# Altium schematic sheet Amplifier.SchDoc
size A4; SheetNumber: 1; SheetTotal: 1
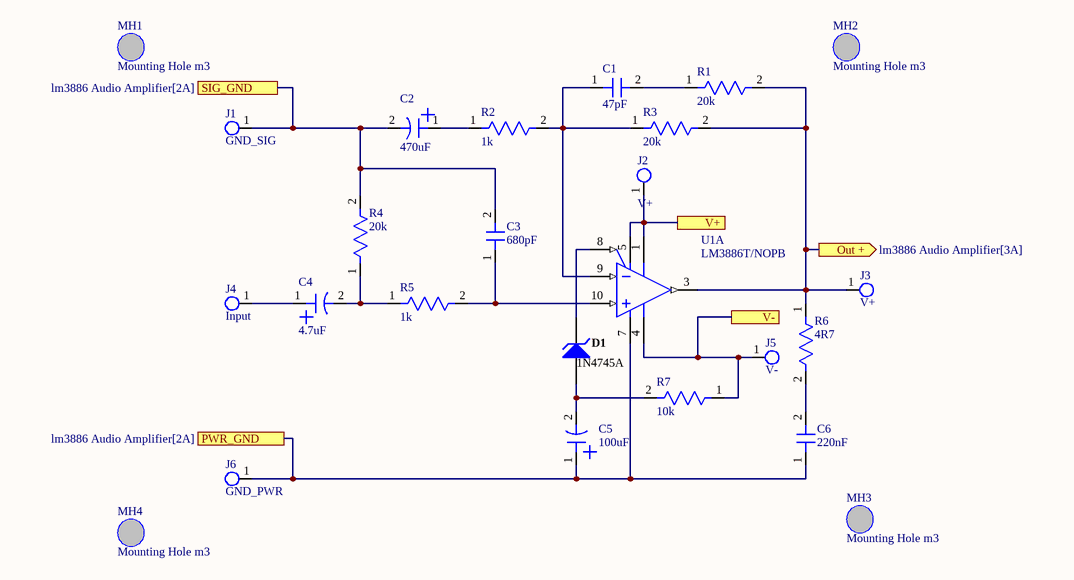
[diagram p0: Amplifier.SchDoc]

## Parts
C1  47pF  [Capacitor P5 2.4x4.4mm]
C2  470uF  [Capacitor electrolytic 10x16mm]
C3  680pF  [Capacitor P5 2.4x4.4mm]
C4  4.7uF  [Capacitor electrolytic 5x11mm]
C5  100uF  [Capacitor electrolytic 6x11mm]
C6  220nF  [Capacitor P5 5x7.5mm]
D1  1N4745A  [FAIR-DO-41-2_V]
J1  GND_SIG  [Terminal 6.3mm male]
J2  V+  [Terminal 6.3mm male]
J3  V+  [Terminal 6.3mm male]
J4  Input  [Terminal 6.3mm male]
J5  V-  [Terminal 6.3mm male]
J6  GND_PWR  [Terminal 6.3mm male]
MH1  Mounting Hole m3  [Mounting Hole]
MH2  Mounting Hole m3  [Mounting Hole]
MH3  Mounting Hole m3  [Mounting Hole]
MH4  Mounting Hole m3  [Mounting Hole]
R1  20k  [Resistor 0207 1/4W]
R2  1k  [Resistor 0207 1/4W]
R3  20k  [Resistor 0207 1/4W]
R4  20k  [Resistor 0207 1/4W]
R5  1k  [Resistor 0207 1/4W]
R6  4R7  [Resistor 0617 2W]
R7  10k  [Resistor 0207 1/4W]
U1  LM3886T/NOPB  [TI-NDJ11]  (part A of 2)

## Ports
Out + (out, see lm3886 Audio Amplifier[3A]), PWR_GND (see lm3886 Audio Amplifier[2A]), SIG_GND (see lm3886 Audio Amplifier[2A]), V+ (see lm3886 Audio Amplifier[2A]), V- (see lm3886 Audio Amplifier[2A])

## Nets
Out +: J3.1 R1.2 R3.2 R6.1 U1.3(OUTPUT) ; port Out +
PWR_GND: C5.1 C6.1 J6.1 U1.7(GND) ; port PWR_GND
SIG_GND: C2.2 C3.2 J1.1 R4.2 ; port SIG_GND
V+: J2.1 U1.1(V+) U1.5(V+) ; port V+
V-: J5.1 R7.1 U1.4(V-) ; port V-
NetC1_1: C1.1 R2.2 R3.1 U1.9(VIN-)
NetC1_2: C1.2 R1.1
NetC2_1: C2.1 R2.1
NetC3_1: C3.1 R5.2 U1.10(VIN+)
NetC4_1: C4.1 J4.1
NetC4_2: C4.2 R4.1 R5.1
NetC5_2: C5.2 D1.1(A) R7.2
NetC6_2: C6.2 R6.2
NetD1_2: D1.2(K) U1.8(MUTE)

## Library data of the parts
C1 C3 C6 = Capacitor
C2 C4 C5 = Capacitor Polar
D1 = CMP-0892-00004-1: Zener Diode, 16V, 1W, 5%, -65 to 200 degC, 2-Pin DO-41, Body 2.72 x 5.2 mm, RoHS; Manufacturer: Fairchild Semiconductor; VZ (Max.) (V): 16.8; PD (W): 1; IR (uA): 5; Test Current IZ (mA): 15.5; VZ (Min.) (V): 15.2; ZZ (Max) (ohm): 14; ComponentLink2Description: Datasheet; DatasheetVersion: Rev. H3; Tolerance: 5%; Mounting Technology: Through Hole; PartNumber: 1N4745A; ComponentLink3URL: http://www.fairchildsemi.com/dwg/DO/DO41A.pdf; ComponentLink2URL: http://www.fairchildsemi.com/ds/1N/1N4744A.pdf; ComponentLink3Description: Package Specification; Operating and Storage Temperature Range: -65 to 200 degC; ComponentLink1Description: Manufacturer URL; PackageDescription: 2-Pin Axial leaded, Body 2.72 x 5.2 mm, Lead Spread 25.4 mm; RoHS: TRUE; ComponentLink1URL: http://www.fairchildsemi.com/; PackageReference: DO-41-2; PackageVersion: Rev. 2
J1-J6 = 6.3mm Male Terminal
R1-R7 = Resistor
U1 = CMP-0994-00122-1: High-Performance 68 W Audio Power Amplifier with Mute, 0 to 70 degC, 11-pin FM (NDJ11), Green (RoHS & no Sb/Br); Manufacturer: Texas Instruments; Input Type: Analog; SubFamily: Mid/High-Power Amplifier; PackageVersion: Rev. B, 05/2013; ComponentLink2Description: Datasheet; DatasheetVersion: SNAS091C; PackageReference: NDJ11; ComponentLink3Description: Package Specification; ComponentLink1URL: http://www.ti.com/; Mounting Technology: Through Hole; ComponentLink1Description: Manufacturer URL; PartNumber: LM3886T/NOPB; PackageDescription: 11-Pin Metal Flange Mount, Body 20.02 x 4.5, Pitch 1.7 mm; Eco-Plan: Green (RoHS & no Sb/Br); ComponentLink2URL: http://www.ti.com/general/docs/lit/getliterature.tsp?genericPartNumber=LM3886&fileType=pdf; ComponentLink3URL: http://www.ti.com/lit/ds/symlink/lm3886.pdf